# Altium project STM32F4_Board.PrjPcb
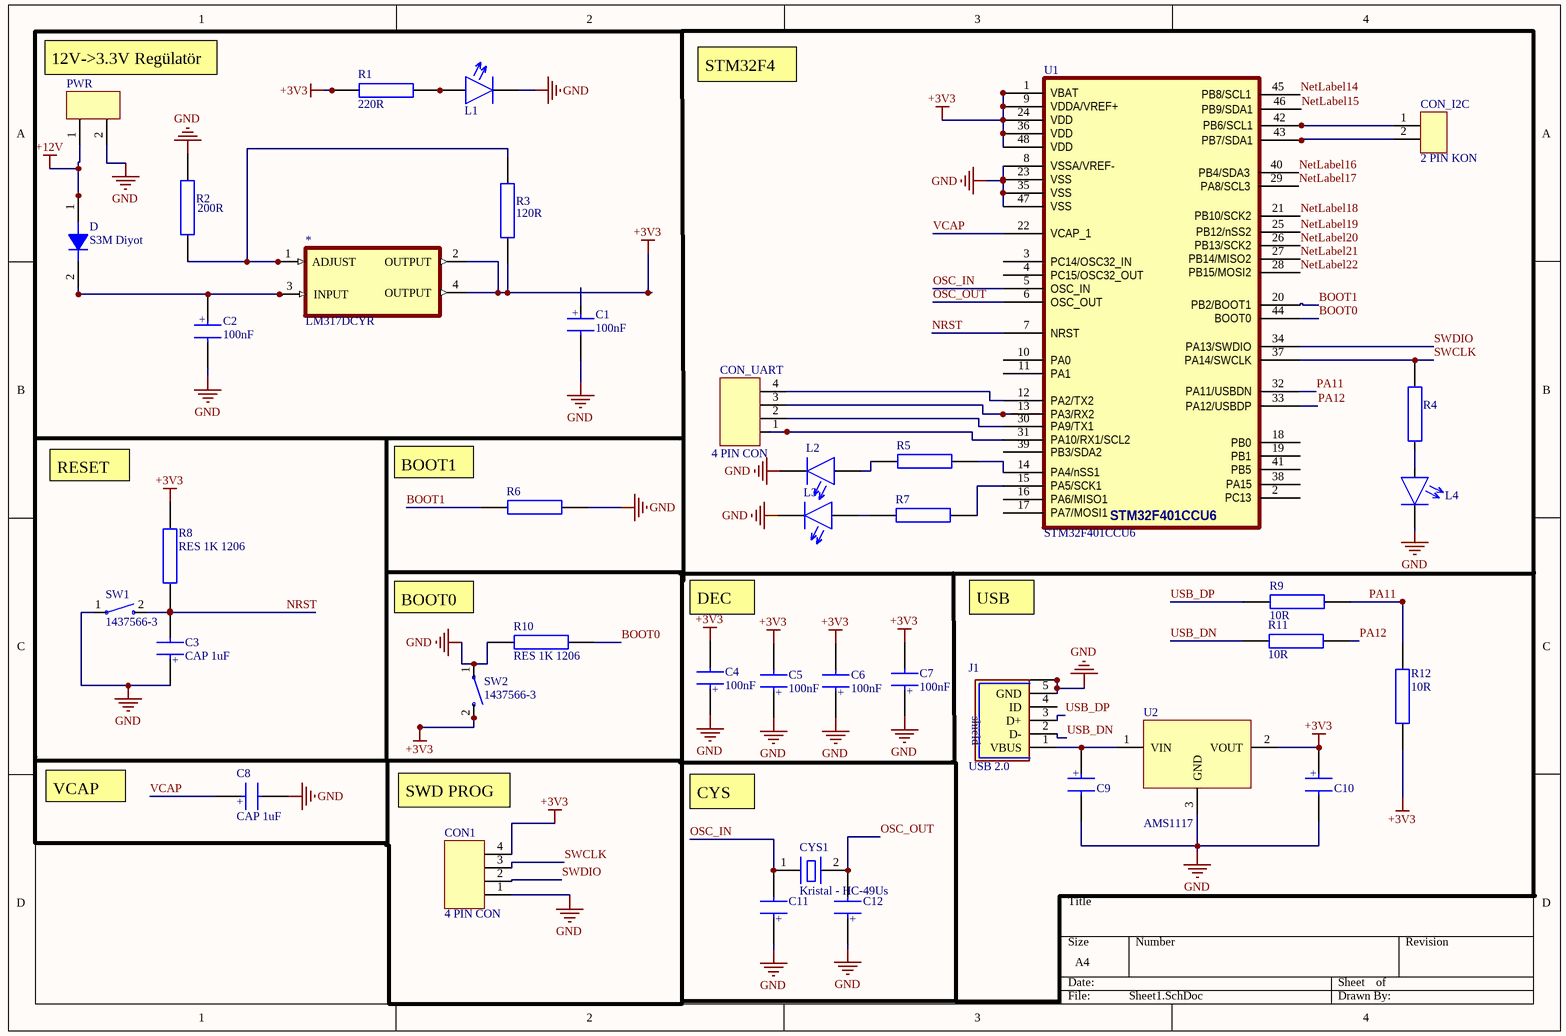
[diagram p0: Sheet1.SchDoc]
1 sheet, 40 parts. Net scope: global (net labels, ports and power ports of the same name join across sheets).
Board file: PCB1.PcbDoc

## Sheet Sheet1.SchDoc
size A4; SheetNumber: 1; SheetTotal: 1

### Parts
*  LM317DCYR  [SOT230P700X180-4N]
C1  100nF  [CAP_805]
C2  100nF  [CAP_805]
C3  CAP 1uF  [CAP_805]
C4  100nF  [CAP_805]
C5  100nF  [CAP_805]
C6  100nF  [CAP_805]
C7  100nF  [CAP_805]
C8  CAP 1uF  [CAP_805]
C9  CAP 1uF  [CAP_805]  (value not drawn)
C10  CAP 1uF  [CAP_805]  (value not drawn)
C11  CAP 0.1uF  [CAP_805]  (value not drawn)
C12  CAP 1uF  [CAP_805]  (value not drawn)
CON1  4 PIN CON  [4 PIN 2.54MM]
CON_I2C  2 PIN KON  [2 PIN 2.54MM]
CON_UART  4 PIN CON  [4 PIN 2.54MM]
CYS1  Kristal - HC-49Us  [Kristal - HC-49Us -smd]
D  S3M Diyot  [DO214AA]
J1  USB 2.0  [65100516121]
L1  Led Red  [Led 1206]  (value not drawn)
L2  Led Red  [Led 1206]  (value not drawn)
L3  Led Red  [Led 1206]  (value not drawn)
L4  Led Red  [Led 1206]  (value not drawn)
PWR  2 Pin Klemens  [5.08mm-2 pin]  (value not drawn)
R1  220R  [RES_1206]
R2  200R  [RES_1206]
R3  120R  [RES_1206]
R4  RES 100R 1206  [RES_1206]  (value not drawn)
R5  RES 100R 1206  [RES_1206]  (value not drawn)
R6  RES 100R 1206  [RES_1206]  (value not drawn)
R7  RES 100R 1206  [RES_1206]  (value not drawn)
R8  RES 1K 1206  [RES_1206]
R9  10R  [RES_1206]
R10  RES 1K 1206  [RES_1206]
R11  10R  [RES_1206]
R12  10R  [RES_1206]
SW1  1437566-3  [SW_1437566-3]
SW2  1437566-3  [SW_1437566-3]
U1  STM32F401CCU6  [UFQFPN48]
U2  AMS1117  [AMS1117]

### Nets
+3V3: *.2(OUTPUT) *.4(OUTPUT) C4.2 C5.2 C6.2 C7.2 C10.1 CON1.4 R1.1 R3.1 R8.2 R12.2 SW2.2 U1.1(VBAT) U1.9(VDDA/VREF+) U1.24(VDD) U1.36(VDD) U1.48(VDD) U2.2(VOUT)
+12V: D.1 PWR.1
GND: C1.2 C2.2 C3.1 C4.1 C5.1 C6.1 C7.1 C8.2 C9.2 C10.2 C11.1 C12.1 CON1.1 J1.5(GND) J1.S1(SHIELD) J1.S2(SHIELD) J1.S3(SHIELD) J1.S4(SHIELD) L1.2 L2.2 L3.2 L4.2 PWR.2 R2.2 R6.2 R10.2 SW1.1 SW2.1 U1.8(VSSA/VREF-) U1.23(VSS) U1.35(VSS) U1.47(VSS) U2.3(GND)
BOOT0: R10.1 U1.44(BOOT0)
BOOT1: R6.1 U1.20(PB2/BOOT1)
NetLabel14: U1.45(PB8/SCL1)
NetLabel15: U1.46(PB9/SDA1)
NetLabel16: U1.40(PB4/SDA3)
NetLabel17: U1.29(PA8/SCL3)
NetLabel18: U1.21(PB10/SCK2)
NetLabel19: U1.25(PB12/nSS2)
NetLabel20: U1.26(PB13/SCK2)
NetLabel21: U1.27(PB14/MISO2)
NetLabel22: U1.28(PB15/MOSI2)
NRST: C3.2 R8.1 SW1.2 U1.7(NRST)
OSC_IN: C11.2 CYS1.1 U1.5(OSC_IN)
OSC_OUT: C12.2 CYS1.2 U1.6(OSC_OUT)
PA11: R9.2 R12.1 U1.32(PA11/USBDN)
PA12: R11.2 U1.33(PA12/USBDP)
SWCLK: CON1.3 R4.2 U1.37(PA14/SWCLK)
SWDIO: CON1.2 U1.34(PA13/SWDIO)
USB_DN: J1.2(D-) R11.1
USB_DP: J1.3(D+) R9.1
VCAP: C8.1 U1.22(VCAP_1)
Net*_1: *.1(ADJUST) R2.1 R3.2
Net*_3: *.3(INPUT) C2.1 D.2
NetC9_1: C9.1 J1.1(VBUS) U2.1(VIN)
NetCON_I2C_1: CON_I2C.1 U1.42(PB6/SCL1)
NetCON_I2C_2: CON_I2C.2 U1.43(PB7/SDA1)
NetCON_UART_1: CON_UART.1 U1.31(PA10/RX1/SCL2)
NetCON_UART_2: CON_UART.2 U1.30(PA9/TX1)
NetCON_UART_3: CON_UART.3 U1.13(PA3/RX2)
NetCON_UART_4: CON_UART.4 U1.12(PA2/TX2)
NetL1_1: L1.1 R1.2
NetL2_1: L2.1 R5.1
NetL3_1: L3.1 R7.1
NetL4_1: L4.1 R4.1
NetR5_2: R5.2 U1.14(PA4/nSS1)
NetR7_2: R7.2 U1.15(PA5/SCK1)

Not connected (* = marked no-connect by the designer): C1 1; J1 4(ID); U1 2(PC13) 3(PC14/OSC32_IN) 4(PC15/OSC32_OUT) 10(PA0) 11(PA1) 16(PA6/MISO1) 17(PA7/MOSI1) 18(PB0) 19(PB1) 38(PA15) 39(PB3/SDA2) 41(PB5)

### Notes on the sheet
- (near PWR) 12V->3.3V Regülatör
- STM32F4
- RESET
- (near R6) BOOT1
- BOOT0
- DEC
- USB
- VCAP
- SWD PROG
- CYS
- (in symbol CAP 1uF) +
- (in symbol USB 2.0) shield

### Library data of the parts
C1-C12 = CAP 1uF: 0805 smd
CON1 CON_UART = 4 PIN CON: 2.54mm vertical connector
CON_I2C = 2 PIN KON: 2.54 mm vertical
CYS1 = Kristal - HC-49Us: Smd tipi kristal
D = S3M Diyot: Current: 3A; Voltage: 1000V; Case/Package: DO214AA
J1 = USB 2.0: USB - mini B USB 2.0 Receptacle Connector 5 Position Surface Mount, Right Angle; MF: WÃ¼rth Elektronik; MP: 65100516121; Purchase-URL: https://pricing.snapeda.com/search/part/65100516121/?ref=eda; SnapEDA_Link: https://www.snapeda.com/parts/65100516121/Wurth+Elektronik/view-part/?ref=snap; Price: None; Package: None; Value: *; Check_prices: https://www.snapeda.com/parts/65100516121/Wurth+Elektronik/view-part/?ref=eda; Availability: In Stock
PWR = 2 Pin Klemens: 5.08mm 2 pin klemens
R1-R3 = RES 100R 1206
R9 R11 R12 = RES 1K 1206
SW1 SW2 = 1437566-3: Switch Tactile OFF (ON) SPST Rectangular Button Gull Wing 0.05A 12VDC SMD Loose Piece; Price: None; Value: *; Package: None; Availability: Unavailable; MP: 1437566-3
U2 = AMS1117: 3V3 Voltage Regulator; Iout: 1A; Vmax: 12V; Case/Package: SOT-89